# Altium schematic sheet Schematic Band Pass.SchDoc
size A4; SheetNumber: 1; SheetTotal: 2
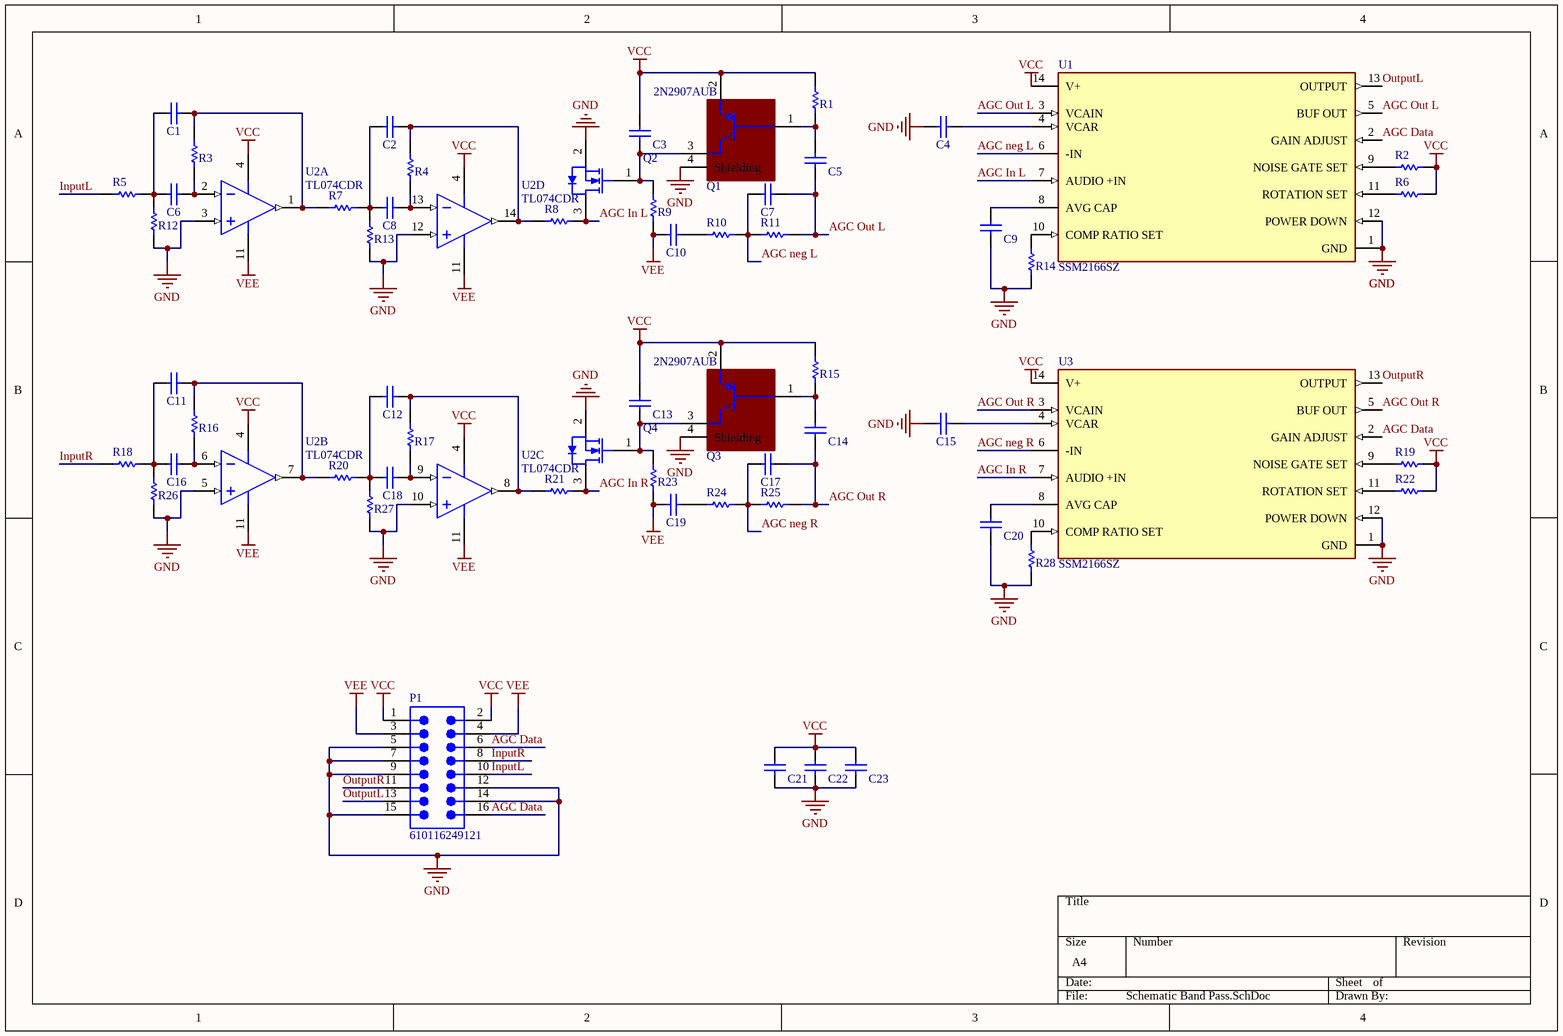
[diagram p0: Schematic Band Pass.SchDoc]

## Parts
C1  1206GC102KAT1A  [AVX-1206-2_L]  (value not drawn)
C2  1206GC102KAT1A  [AVX-1206-2_L]  (value not drawn)
C3  1206GC102KAT1A  [AVX-1206-2_L]  (value not drawn)
C4  1206GC102KAT1A  [AVX-1206-2_L]  (value not drawn)
C5  1206GC102KAT1A  [AVX-1206-2_L]  (value not drawn)
C6  1206GC102KAT1A  [AVX-1206-2_L]  (value not drawn)
C7  1206GC102KAT1A  [AVX-1206-2_L]  (value not drawn)
C8  1206GC102KAT1A  [AVX-1206-2_L]  (value not drawn)
C9  1206GC102KAT1A  [AVX-1206-2_L]  (value not drawn)
C10  1206GC102KAT1A  [AVX-1206-2_L]  (value not drawn)
C11  1206GC102KAT1A  [AVX-1206-2_L]  (value not drawn)
C12  1206GC102KAT1A  [AVX-1206-2_L]  (value not drawn)
C13  1206GC102KAT1A  [AVX-1206-2_L]  (value not drawn)
C14  1206GC102KAT1A  [AVX-1206-2_L]  (value not drawn)
C15  1206GC102KAT1A  [AVX-1206-2_L]  (value not drawn)
C16  1206GC102KAT1A  [AVX-1206-2_L]  (value not drawn)
C17  1206GC102KAT1A  [AVX-1206-2_L]  (value not drawn)
C18  1206GC102KAT1A  [AVX-1206-2_L]  (value not drawn)
C19  1206GC102KAT1A  [AVX-1206-2_L]  (value not drawn)
C20  1206GC102KAT1A  [AVX-1206-2_L]  (value not drawn)
C21  1206GC102KAT1A  [AVX-1206-2_L]  (value not drawn)
C22  1206GC102KAT1A  [AVX-1206-2_L]  (value not drawn)
C23  1206GC102KAT1A  [AVX-1206-2_L]  (value not drawn)
P1  610116249121  [610116249121]
Q1  2N2907AUB  [FP-UB-IPC_C]
Q2  2N7002-T1-E3  [VISH-TO-236-3_A_L]  (value not drawn)
Q3  2N2907AUB  [FP-UB-IPC_C]
Q4  2N7002-T1-E3  [VISH-TO-236-3_A_L]  (value not drawn)
R1  ERJ-8GEY0R00V  [RESC3216X70X50NL05T20]  (value not drawn)
R2  ERJ-8GEY0R00V  [RESC3216X70X50NL05T20]  (value not drawn)
R3  ERJ-8GEY0R00V  [RESC3216X70X50NL05T20]  (value not drawn)
R4  ERJ-8GEY0R00V  [RESC3216X70X50NL05T20]  (value not drawn)
R5  ERJ-8GEY0R00V  [RESC3216X70X50NL05T20]  (value not drawn)
R6  ERJ-8GEY0R00V  [RESC3216X70X50NL05T20]  (value not drawn)
R7  ERJ-8GEY0R00V  [RESC3216X70X50NL05T20]  (value not drawn)
R8  ERJ-8GEY0R00V  [RESC3216X70X50NL05T20]  (value not drawn)
R9  ERJ-8GEY0R00V  [RESC3216X70X50NL05T20]  (value not drawn)
R10  ERJ-8GEY0R00V  [RESC3216X70X50NL05T20]  (value not drawn)
R11  ERJ-8GEY0R00V  [RESC3216X70X50NL05T20]  (value not drawn)
R12  ERJ-8GEY0R00V  [RESC3216X70X50NL05T20]  (value not drawn)
R13  ERJ-8GEY0R00V  [RESC3216X70X50NL05T20]  (value not drawn)
R14  ERJ-8GEY0R00V  [RESC3216X70X50NL05T20]  (value not drawn)
R15  ERJ-8GEY0R00V  [RESC3216X70X50NL05T20]  (value not drawn)
R16  ERJ-8GEY0R00V  [RESC3216X70X50NL05T20]  (value not drawn)
R17  ERJ-8GEY0R00V  [RESC3216X70X50NL05T20]  (value not drawn)
R18  ERJ-8GEY0R00V  [RESC3216X70X50NL05T20]  (value not drawn)
R19  ERJ-8GEY0R00V  [RESC3216X70X50NL05T20]  (value not drawn)
R20  ERJ-8GEY0R00V  [RESC3216X70X50NL05T20]  (value not drawn)
R21  ERJ-8GEY0R00V  [RESC3216X70X50NL05T20]  (value not drawn)
R22  ERJ-8GEY0R00V  [RESC3216X70X50NL05T20]  (value not drawn)
R23  ERJ-8GEY0R00V  [RESC3216X70X50NL05T20]  (value not drawn)
R24  ERJ-8GEY0R00V  [RESC3216X70X50NL05T20]  (value not drawn)
R25  ERJ-8GEY0R00V  [RESC3216X70X50NL05T20]  (value not drawn)
R26  ERJ-8GEY0R00V  [RESC3216X70X50NL05T20]  (value not drawn)
R27  ERJ-8GEY0R00V  [RESC3216X70X50NL05T20]  (value not drawn)
R28  ERJ-8GEY0R00V  [RESC3216X70X50NL05T20]  (value not drawn)
U1  SSM2166SZ  [FP-R-14-IPC_C]
U2  TL074CDR  [D0014A_N]  (parts A,B,C,D of 4)
U3  SSM2166SZ  [FP-R-14-IPC_C]

## Nets
GND: C4.1 C9.1 C15.1 C20.1 C21.1 C22.1 C23.1 P1.5 P1.7 P1.9 P1.12 P1.14 P1.15 Q1.4(Shielding) Q2.2(S) Q3.4(Shielding) Q4.2(S) R12.1 R13.1 R14.1 R26.1 R27.1 R28.1 U1.1(GND) U1.12(POWER_DOWN) U2.3(IN1+) U2.5(IN2+) U2.10(IN3+) U2.12(IN4+) U3.1(GND) U3.12(POWER_DOWN)
VCC: C3.1 C13.1 C21.2 C22.2 C23.2 P1.1 P1.2 Q1.2(E) Q3.2(E) R1.2 R2.2 R6.2 R15.2 R19.2 R22.2 U1.14(V+) U2.4(VCC+) U3.14(V+)
VEE: C10.1 C19.1 P1.3 P1.4 R9.1 R23.1 U2.11(VCC-)
AGC Data: P1.6 P1.16 U1.2(GAIN_ADJUST) U3.2(GAIN_ADJUST)
AGC In L: Q2.3(D) R8.2 U1.7(AUDIO_+IN)
AGC In R: Q4.3(D) R21.2 U3.7(AUDIO_+IN)
AGC neg L: C7.1 R10.2 R11.1 U1.6(-IN)
AGC neg R: C17.1 R24.2 R25.1 U3.6(-IN)
AGC Out L: C5.2 C7.2 R11.2 U1.3(VCAIN) U1.5(BUF_OUT)
AGC Out R: C14.2 C17.2 R25.2 U3.3(VCAIN) U3.5(BUF_OUT)
InputL: P1.10 R5.1
InputR: P1.8 R18.1
OutputL: P1.13 U1.13(OUTPUT)
OutputR: P1.11 U3.13(OUTPUT)
NetC1_1: C1.1 C6.1 R5.2 R12.2
NetC1_2: C1.2 R3.2 R7.1 U2.1(OUT1)
NetC2_1: C2.1 C8.1 R7.2 R13.2
NetC2_2: C2.2 R4.2 R8.1 U2.14(OUT4)
NetC3_2: C3.2 Q1.3(C) Q2.1(G) R9.2
NetC4_2: C4.2 U1.4(VCAR)
NetC5_1: C5.1 Q1.1(B) R1.1
NetC6_2: C6.2 R3.1 U2.2(IN1-)
NetC8_2: C8.2 R4.1 U2.13(IN4-)
NetC9_2: C9.2 U1.8(AVG_CAP)
NetC10_2: C10.2 R10.1
NetC11_1: C11.1 C16.1 R18.2 R26.2
NetC11_2: C11.2 R16.2 R20.1 U2.7(OUT2)
NetC12_1: C12.1 C18.1 R20.2 R27.2
NetC12_2: C12.2 R17.2 R21.1 U2.8(OUT3)
NetC13_2: C13.2 Q3.3(C) Q4.1(G) R23.2
NetC14_1: C14.1 Q3.1(B) R15.1
NetC15_2: C15.2 U3.4(VCAR)
NetC16_2: C16.2 R16.1 U2.6(IN2-)
NetC18_2: C18.2 R17.1 U2.9(IN3-)
NetC19_2: C19.2 R24.1
NetC20_2: C20.2 U3.8(AVG_CAP)
NetR2_1: R2.1 U1.9(NOISE_GATE_SET)
NetR6_1: R6.1 U1.11(ROTATION_SET)
NetR14_2: R14.2 U1.10(COMP_RATIO_SET)
NetR19_1: R19.1 U3.9(NOISE_GATE_SET)
NetR22_1: R22.1 U3.11(ROTATION_SET)
NetR28_2: R28.2 U3.10(COMP_RATIO_SET)

## Library data of the parts
C1-C23 = CMP-2000-05468-1: Chip Capacitor, 1 nF, +/- 10%, -55 to 125 degC, 1206 (3216 Metric), RoHS, Tape and Reel; Manufacturer: AVX; Capacitance: 0.001uF; Dielectric: X7R; Voltage Rating DC: 2000V; Package Reference: 1206; Datasheet Version: 11/2010; Mounting Technology: SurfaceMount; Manufacturer URL: http://www.avx.com/; Tolerance: 10%; Tolerance (%): ±10%; PartNumber: 1206GC102KAT1A; Datasheet URL: https://datasheet.ciiva.com/11787/0900766b80ed4c37-11787781.pdf; Package Description: 2-Pin SMD, Body 3.4 x 1.8 mm; Case Size/Dimension: 1206; Rated Voltage: 2000V
P1 = CMP-1502-01151-2: NexarPartId: 52645099; Gender: Male; Number of Contacts: 16; Contact Resistance: 20mΩ; Row Spacing: 2.54mm; Operating Supply Voltage: 250V; Current Rating: 3A; Connector Type: Male Pin; REACH SVHC: Unknown; Termination: Solder; Number of Rows: 2; Packaging: Tape and Reel; Color: Black; Number of Pins: 16; Contact Plating: Gold; Mount: Surface Mount; Pitch: 2.54mm; Number of Positions: 16; Lead Pitch: 2.54mm; Contact Mating Length: 5.9944mm; RoHS: Compliant
Q1 Q3 = CMP-06567-000003-1: TRANS PNP 60V 0.6A; Manufacturer: Microsemi; Max Junction Temp: +200°C; Hfe Max: 300; Number Of Elements: 1; Hfe Testvce: 10V; Hfe Ss Min: 100; Hfe Ss Testic: 1mA; Max Collector Current: 600mA; Emitter Base Voltage: 5V; Power Dissipation: 0.5W; Hfe Testic: 150mA; Collector Emitter Saturation Voltage: 1.6V; Digikey Description: TRANS PNP 60V 0.6A; Collector Base Voltage: 60V; Collector Emitter Breakdown Voltage: 60V; Manufacturer Part Number: 2N2907AUB; Lead Free: Yes; Category: Trans; Height: 1.42mm; Temperature Range Low: -65°C; Hfe Ss Testvce: 10V; Mouser Description: Bipolar Transistors - BJT Small-Signal BJT; Collector Emitter Voltage: 60V; Number Of Pnp: 1; Package: UB; Temperature Range High: +200°C; Device Class L1: Discrete Semiconductors; Octopart: https://octopart.com/2n2907aub-microsemi-2441590; Hfe Min: 100; ComponentLink2URL: https://www.microsemi.com/document-portal/doc_download/8896-lds-0059-datasheet; Device Class L2: Transistors; Device Class L3: BJTs; Automotive: No; RoHS: TRUE; Temperature: -65°C to +200°C; ComponentLink2Description: Datasheet
Q2 Q4 = CMP-2000-05565-1: N-Channel MOSFET, 115 mA, 60 V, -55 to 150 degC, 3-Pin SOT23, RoHS, Tape and Reel; Manufacturer: Vishay; Continuous Drain Current Id: 115mA; Threshold Voltage Vgs: 2.1V; Transistor Case Style: TO-236; On Resistance Rds(on): 7.5ohm; Transistor Polarity: NChannel; Power Dissipation Pd: 200mW; No. of Pins: 3; SVHC: NoSVHC(17-Dec-2014); Drain Source Voltage Vds: 60V; Rds(on) Test Voltage Vgs: 10V; Package URL: http://www.vishay.com/docs/71196/71196.pdf; Package Description: 3-Pin Small Outline Transistor, Body 2.92 x 1.3 mm, Pitch 0.95 mm; Datasheet URL: http://www.vishay.com/docs/70226/70226.pdf; Package Reference: TO-236-3; MSL: MSL1-Unlimited; Mounting Technology: SurfaceMount; Operating Temperature Max: 150°C; Datasheet Version: Rev. F, 07/2001; Manufacturer URL: http://www.vishay.com/
R1-R28 = CMP-2003-00541-1: Manufacturer: Panasonic; Part Number: ERJ-8GEY0R00V
U1 U3 = CMP-09115-000002-1: IC AMP CLASS AB MONO 14SOIC; Load Impedance: 75R; Quiescent Current: 7.5mA; Power Supply Rejection Ratio (PSRR): 50dB; Number of Channels: 1; Unity Gain Bandwidth Product: 30MHz; Gain: 60dB; Operating Supply Current: 10mA; Bandwidth: 20MHz; Min Supply Voltage: 4.5V; Supply Type: Single; Max Supply Voltage: 5.5V; Operating Supply Voltage: 5V; Height: 1.5mm; Supply Current: 7.5mA; Series: -; Max Operating Temperature: 85°C; Case/Package: SOIC; Radiation Hardening: No; Number of Pins: 14; Lead Free: Contains Lead; Package Quantity: 56; Gain Bandwidth Product: 30MHz; Number of Amplifiers: 1; Contact Plating: Tin; Nominal Supply Current: 10mA; RoHS Compliant: Yes; Width: 4mm; Voltage Gain: 60dB; Packaging: Rail/Tube; REACH SVHC: No SVHC; Mount: Surface Mount; Length: 8.75mm; Min Operating Temperature: -40°C; Max Supply Current: 10mA
U2 = CMP-0017-00003-2: Quad Low-Noise JFET-Input General-Purpose Operational Amplifier, 7 to 36 V, 0 to 70 degC, 14-pin SOIC (D14), Green (RoHS & no Sb/Br); Manufacturer: Texas Instruments; Slew Rate(Typ)(V/us): 13; IIB(Max)(pA): 200; Number of Channels: 4; CMRR(Min)(dB): 70; Vn at 1kHz(Typ)(nV/rtHz): 18; Vio (25C)(Max)(mV): 10; Sub Family: General Purpose Amplifier, High Supply Voltage Amplifier (>=30V); Total Supply Voltage(Max)(+5V is 5, +/-5V is 10): 36; Total Supply Voltage(Min)(+5V is 5, +/-5V is 10): 7; GBW(Typ)(MHz): 3; Rating: Military; Iq per channel(Max)(mA): 2.5; Eco-Plan: Green (RoHS & no Sb/Br); ComponentLink3Description: Package Specification; ComponentLink1URL: http://www.ti.com/; Mounting Technology: Surface Mount; ComponentLink3URL: http://www.ti.com/lit/ml/mpds177g/mpds177g.pdf; PartNumber: TL074CDR; DatasheetVersion: SLOS080J; ComponentLink2URL: http://www.ti.com/lit/ds/symlink/tl074.pdf; ComponentLink1Description: Manufacturer URL; PackageVersion: 4040047-5/M, 06/2011; PackageReference: D0014A; Code_JEDEC: MS-012; ComponentLink2Description: Datasheet; Offset Drift(Typ)(uV/C): 18; PackageDescription: 14-Pin Plastic Small Outline, Body 8.65 x 3.90 mm, Pitch 1.27 mm